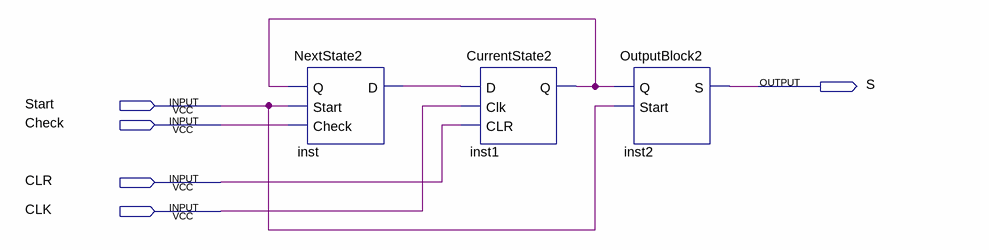
[diagram p0: schematic sheet]
// Quartus schematic Control.bdf as structural Verilog: 3 symbols, 5 pins
module Control (
  input  Start,
  input  Check,
  input  CLR,
  input  CLK,
  output S
);

  wire inst1_q, inst_d;

  NextState2 inst (.Q(inst1_q), .Start(Start), .Check(Check), .D(inst_d));
  CurrentState2 inst1 (.D(inst_d), .Clk(CLK), .CLR(CLR), .Q(inst1_q));
  OutputBlock2 inst2 (.Q(inst1_q), .Start(Start), .S(S));
endmodule
